# Altium schematic sheet ETH_JTAG_SD.SchDoc: Network Module
size 431 x 279 mm; DrawnBy: Bin Xiao; Organization: RYSE Inc.
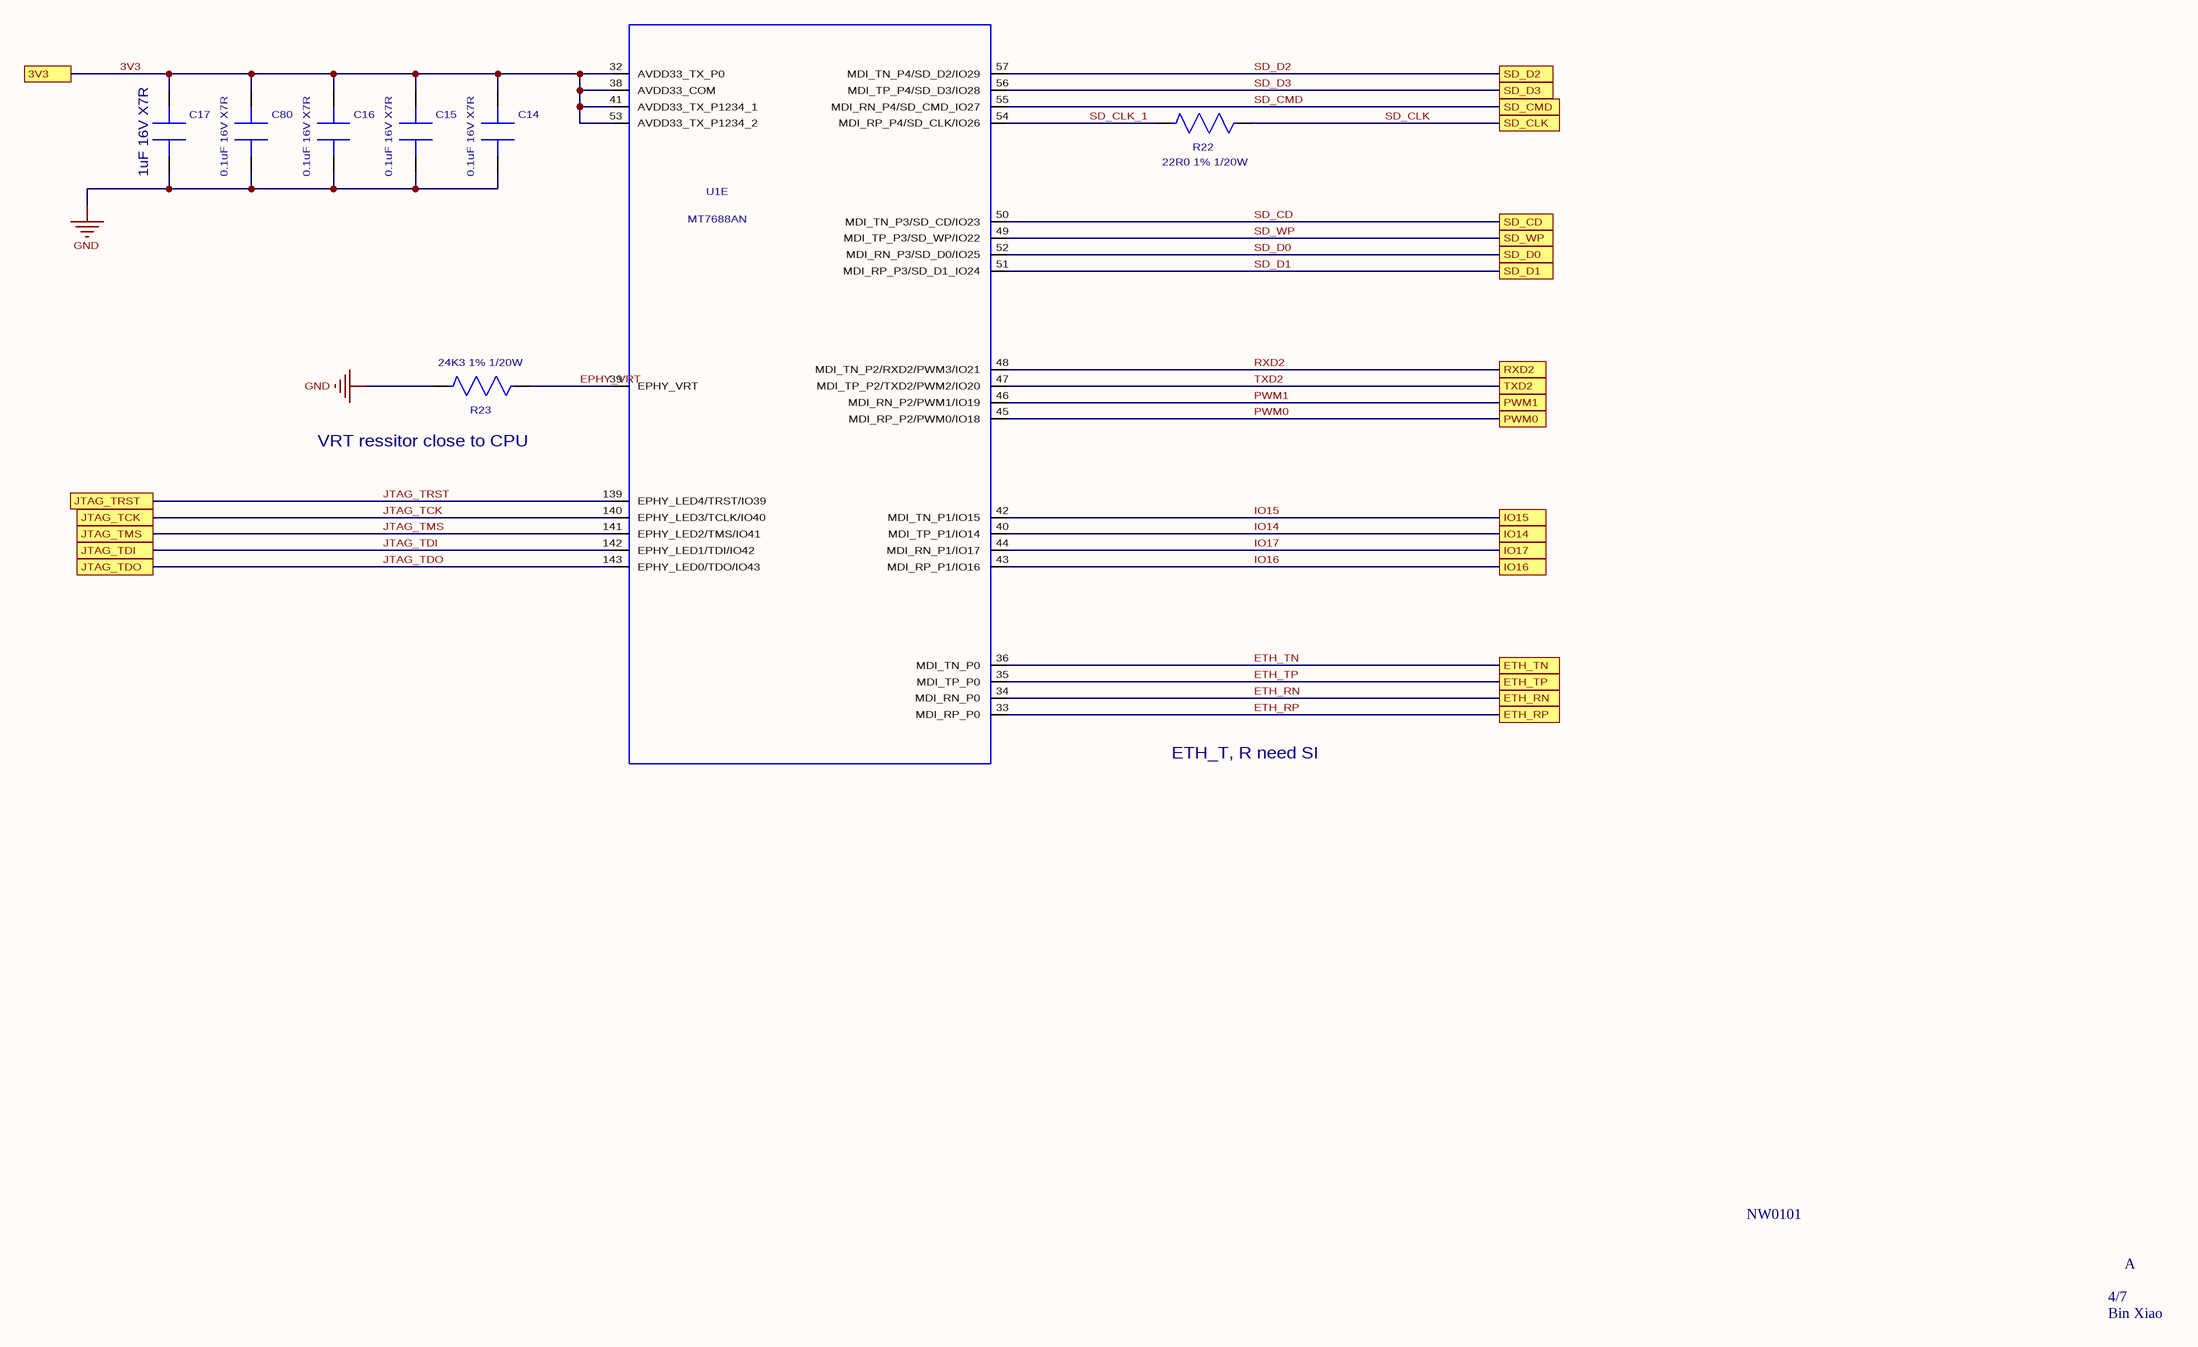
[diagram p0: ETH_JTAG_SD.SchDoc]

## Parts
C14  value 0.1uF 16V X7R  [C0201]  (hidden comment: CAP0201-104-16V-X7R)
C15  value 0.1uF 16V X7R  [C0201]  (hidden comment: CAP0201-104-16V-X7R)
C16  value 0.1uF 16V X7R  [C0201]  (hidden comment: CAP0201-104-16V-X7R)
C17  value 1uF 16V X7R  [C0402]  (hidden comment: CAP0402-105-6.3V-X7R)
C80  value 0.1uF 16V X7R  [C0201]  (hidden comment: CAP0201-104-16V-X7R)
R22  value 22R0 1% 1/20W  [R0201]  (hidden comment: RES0201-22R0)
R23  value 24K3 1% 1/20W  [R0201]  (hidden comment: RES0201-24K3)
U1  MT7688AN  [DR-QFN-128]  (part E of 6)

## Ports
3V3, ETH_RN, ETH_RP, ETH_TN, ETH_TP, IO14, IO15, IO16, IO17, JTAG_TCK, JTAG_TDI, JTAG_TDO, JTAG_TMS, JTAG_TRST, PWM0, PWM1, RXD2, SD_CD, SD_CLK, SD_CMD, SD_D0, SD_D1, SD_D2, SD_D3, SD_WP, TXD2

## Nets
GND: C14.2 C15.2 C16.2 C17.2 C80.2 R23.2
3V3: C14.1 C15.1 C16.1 C17.1 C80.1 U1.32(AVDD33_TX_P0) U1.38(AVDD33_COM) U1.41(AVDD33_TX_P1234_1) U1.53(AVDD33_TX_P1234_2) ; port 3V3
EPHY_VRT: R23.1 U1.39(EPHY_VRT)
ETH_RN: U1.34(MDI_RN_P0) ; port ETH_RN
ETH_RP: U1.33(MDI_RP_P0) ; port ETH_RP
ETH_TN: U1.36(MDI_TN_P0) ; port ETH_TN
ETH_TP: U1.35(MDI_TP_P0) ; port ETH_TP
IO14: U1.40(MDI_TP_P1/IO14) ; port IO14
IO15: U1.42(MDI_TN_P1/IO15) ; port IO15
IO16: U1.43(MDI_RP_P1/IO16) ; port IO16
IO17: U1.44(MDI_RN_P1/IO17) ; port IO17
JTAG_TCK: U1.140(EPHY_LED3/TCLK/IO40) ; port JTAG_TCK
JTAG_TDI: U1.142(EPHY_LED1/TDI/IO42) ; port JTAG_TDI
JTAG_TDO: U1.143(EPHY_LED0/TDO/IO43) ; port JTAG_TDO
JTAG_TMS: U1.141(EPHY_LED2/TMS/IO41) ; port JTAG_TMS
JTAG_TRST: U1.139(EPHY_LED4/TRST/IO39) ; port JTAG_TRST
PWM0: U1.45(MDI_RP_P2/PWM0/IO18) ; port PWM0
PWM1: U1.46(MDI_RN_P2/PWM1/IO19) ; port PWM1
RXD2: U1.48(MDI_TN_P2/RXD2/PWM3/IO21) ; port RXD2
SD_CD: U1.50(MDI_TN_P3/SD_CD/IO23) ; port SD_CD
SD_CLK: R22.1 ; port SD_CLK
SD_CLK_1: R22.2 U1.54(MDI_RP_P4/SD_CLK/IO26)
SD_CMD: U1.55(MDI_RN_P4/SD_CMD_IO27) ; port SD_CMD
SD_D0: U1.52(MDI_RN_P3/SD_D0/IO25) ; port SD_D0
SD_D1: U1.51(MDI_RP_P3/SD_D1_IO24) ; port SD_D1
SD_D2: U1.57(MDI_TN_P4/SD_D2/IO29) ; port SD_D2
SD_D3: U1.56(MDI_TP_P4/SD_D3/IO28) ; port SD_D3
SD_WP: U1.49(MDI_TP_P3/SD_WP/IO22) ; port SD_WP
TXD2: U1.47(MDI_TP_P2/TXD2/PWM2/IO20) ; port TXD2

## Notes on the sheet
- (near R23) VRT ressitor close to CPU
- ETH_T, R need SI
- NW0101
- 4/7
- A
- Bin Xiao

## Library data of the parts
C14-C16 C80 = CAP0201-104-16V-X7R: CAP CER 0.1UF 16V X7R 0201; Part Number: GRM033Z71C104KE14D; Manufacturer: Murata Electronics; Prefered Vender: Digikey; Aligni Value: 0.1u; Type: Capacitor; Geometry.Height: 0.33mm; PCB DECAL: RC0201; Revision: A
C17 = CAP0402-105-6.3V-X7R: CAP CER 1UF 6.3V X7R 0402; Part Number: GRM155R70J105KA12D; Manufacturer: Murata Electronics; Prefered Vender: Digikey; Aligni Value: 1u; Type: Capacitor; Geometry.Height: 0.33mm; PCB DECAL: RC0402; Revision: A
R22 = RES0201-22R0: RES 22 OHM 1% 1/20W 0201; Manufacturer: Yageo; Part Number: RC0201FR-0722RL; Geometry.Height: 0.5mm; Prefered Vender: Digikey; Aligni Value: 22; PCB DECAL: RC0201; Type: Resistor; Revision: A
R23 = RES0201-24K3: RES 24.3K OHM 1% 1/20W 0201; Part Number: RC0201FR-0724K3L; Manufacturer: YAGEO; Prefered Vender: Digikey; Geometry.Height: 0.6mm; PCB DECAL: RC0201; Aligni Value: 24.3k; Revision: A; Type: Resistor
U1 = MT7688AN: 580Mhz 32bits Networking Processor; Manufacturer: MediaTek Inc; Geometry.Height: 0mm; Type: IC; Part Number: MT7688AN; PCB DECAL: DR-QFN-128